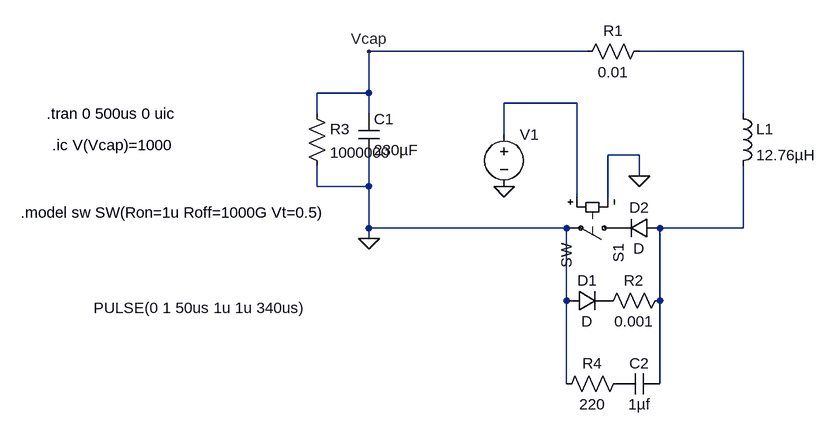
[diagram p0: schematic discharge.asc]
discharge.asc, the LTspice schematic file:
Version 4
SHEET 1 1380 680
WIRE 320 -16 -16 -16
WIRE 560 -16 400 -16
WIRE -16 48 -16 -16
WIRE -16 48 -96 48
WIRE 304 64 192 64
WIRE -96 80 -96 48
WIRE -16 80 -16 48
WIRE 560 80 560 -16
WIRE 192 112 192 64
WIRE 400 144 352 144
WIRE 400 176 400 144
WIRE -96 192 -96 160
WIRE -16 192 -16 144
WIRE -16 192 -96 192
WIRE 304 208 304 64
WIRE 352 208 352 144
WIRE -16 256 -16 192
WIRE 288 256 -16 256
WIRE 560 256 560 160
WIRE 560 256 432 256
WIRE -16 272 -16 256
WIRE 288 368 288 256
WIRE 432 368 432 256
WIRE 288 496 288 368
WIRE 432 496 432 368
FLAG -16 -16 Vcap
FLAG -16 272 0
FLAG 192 192 0
FLAG 400 176 0
SYMBOL res 416 -32 R90
WINDOW 0 0 56 VBottom 2
WINDOW 3 32 56 VTop 2
SYMATTR InstName R1
SYMATTR Value 0.01
SYMBOL ind 544 64 R0
SYMATTR InstName L1
SYMATTR Value 12.76µH
SYMATTR SpiceLine Rser=0
SYMBOL diode 432 240 R90
WINDOW 0 0 32 VBottom 2
WINDOW 3 32 32 VTop 2
SYMATTR InstName D2
SYMBOL res -112 64 R0
SYMATTR InstName R3
SYMATTR Value 1000000
SYMBOL res 448 352 R90
WINDOW 0 0 56 VBottom 2
WINDOW 3 32 56 VTop 2
SYMATTR InstName R2
SYMATTR Value 0.001
SYMBOL res 384 480 R90
WINDOW 0 0 56 VBottom 2
WINDOW 3 32 56 VTop 2
SYMATTR InstName R4
SYMATTR Value 220
SYMBOL cap 432 480 R90
WINDOW 0 0 32 VBottom 2
WINDOW 3 32 32 VTop 2
SYMATTR InstName C2
SYMATTR Value 1µf
SYMBOL diode 288 384 R270
WINDOW 0 32 32 VTop 2
WINDOW 3 0 32 VBottom 2
SYMATTR InstName D1
SYMBOL voltage 192 96 R0
WINDOW 3 -632 283 Left 2
WINDOW 123 0 0 Left 0
WINDOW 39 0 0 Left 0
SYMATTR InstName V1
SYMATTR Value PULSE(0 1 50us 1u 1u 340us)
SYMBOL cap -32 80 R0
SYMATTR InstName C1
SYMATTR Value 230µF
SYMBOL sw 384 256 R90
SYMATTR InstName S1
TEXT -512 80 Left 2 !.tran 0 500us 0 uic
TEXT -504 128 Left 2 !.ic V(Vcap)=1000
TEXT -552 232 Left 2 !.model sw SW(Ron=1u Roff=1000G Vt=0.5)

The netlist it stands for:
* discharge.asc
R1 N001 Vcap 0.01
L1 N001 N003 12.76µH Rser=0
D2 N003 P001 D
R3 Vcap 0 1000000
R2 N003 P002 0.001
R4 P003 0 220
C2 N003 P003 1µf
D1 0 P002 D
V1 N002 0 PULSE(0 1 50us 1u 1u 340us)
C1 Vcap 0 230µF
S1 P001 0 N002 0 SW
.model D D
.lib standard.dio
.tran 0 500us 0 uic
.ic V(Vcap)=1000
.model sw SW(Ron=1u Roff=1000G Vt=0.5)
.backanno
.end